# EAGLE design attinier85-power-shield-mk-2.0 (EAGLE 6.5.0)
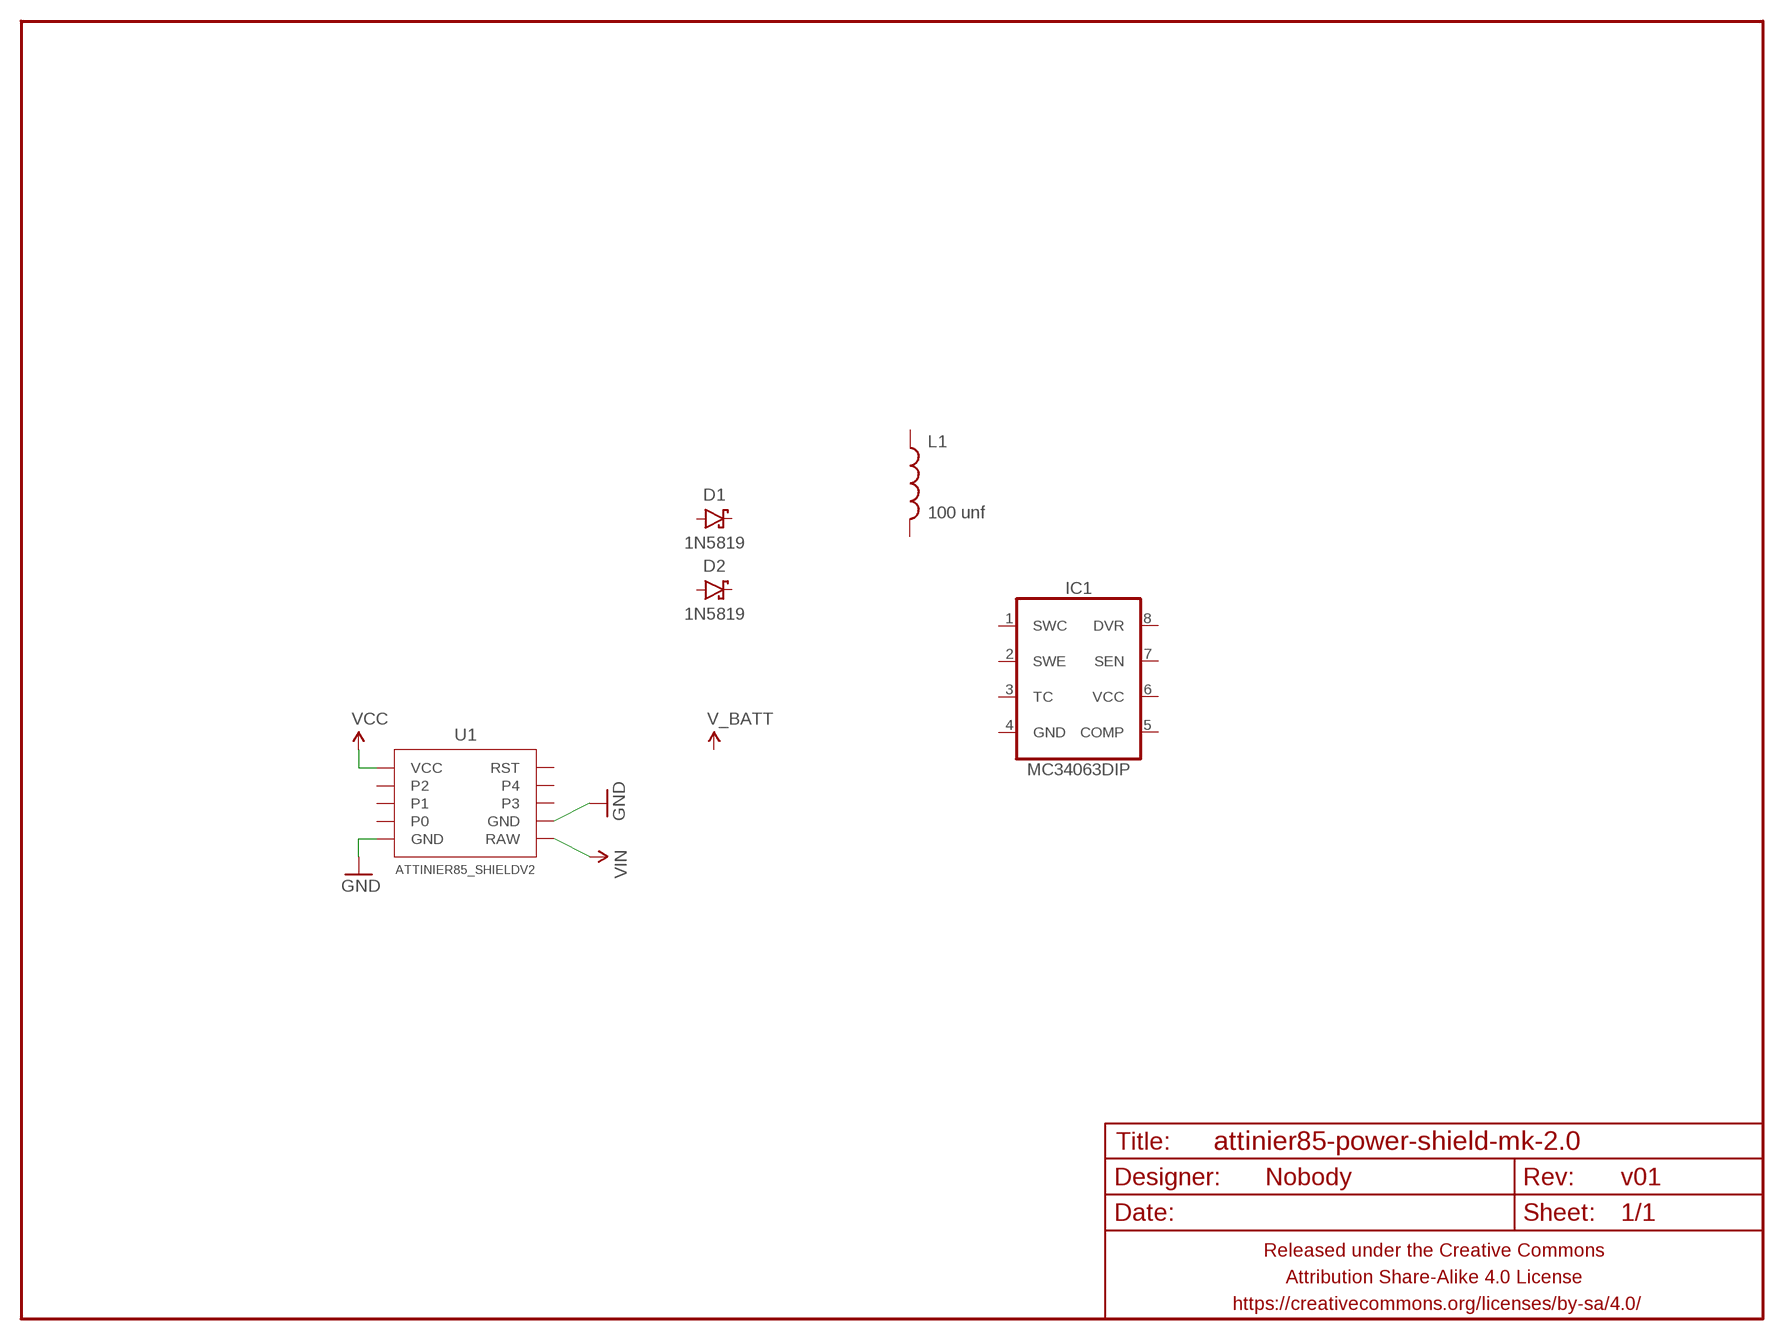
[diagram p0: schematic, sheet 1]

## Parts
D1  1N5819  DIODE-SCHOTTKYPTH-10.16MM  [DIODE-10.16MM]
D2  1N5819  DIODE-SCHOTTKYPTH-10.16MM  [DIODE-10.16MM]
FRAME1  FRAME-LETTERNO_PACKAGE  [DUMMY]
IC1  MC34063DIP  [DIP-08]
L1  100 unf  INDUCTORAXIAL-PTH-10.16MM  [INDUCTOR-AXIAL-PTH-10.16MM]
U1  ATTINIER85_SHIELDV2  [ATTINIER85_SHIELD_V2]

## Nets
GND: U1.GND@1(GND) U1.GND@2(GND)
VCC: U1.VCC
VIN: U1.RAW
Unconnected: D1.A D1.C D2.A D2.C IC1.1(SWC) IC1.2(SWE) IC1.3(TC) IC1.4(GND) IC1.5(COMP) IC1.6(VCC) IC1.7(SEN) IC1.8(DVR) L1.P$1 L1.P$2 U1.0 U1.1 U1.2 U1.3 U1.4 U1.RST

## Library data of the parts
D1 D2 = A_butts:DIODE-SCHOTTKY: Schottky diodes in SFE's production catalog BAT20J 1A 23V 0.62Vf RB751 120mA 40V 0.37Vf PMEG4005EJ 0.5A 40V 0.42Vf MBRA140 1A 40V 0.5Vf B340A 3A 40V SMA
FRAME1 = A_butts:FRAME-LETTER: Schematic Frame Standard 8.5x11 US Letter frame; DESIGNER: Nobody; VERSION: v01
IC1 = A_butts:MC34063: Jellybean switching supply controller
L1 = A_butts:INDUCTOR: Inductors Basic Inductor/Choke - 0603 and 1206. Footprints are not proven and vary greatly between part numbers. SRN6045- 33uH, 20% 1.4A SDR0403-560KL - 56uH, 10%, 500mA RMS/740mA peak
U1 = A_butts:ATTINIER85_SHIELD

## Board
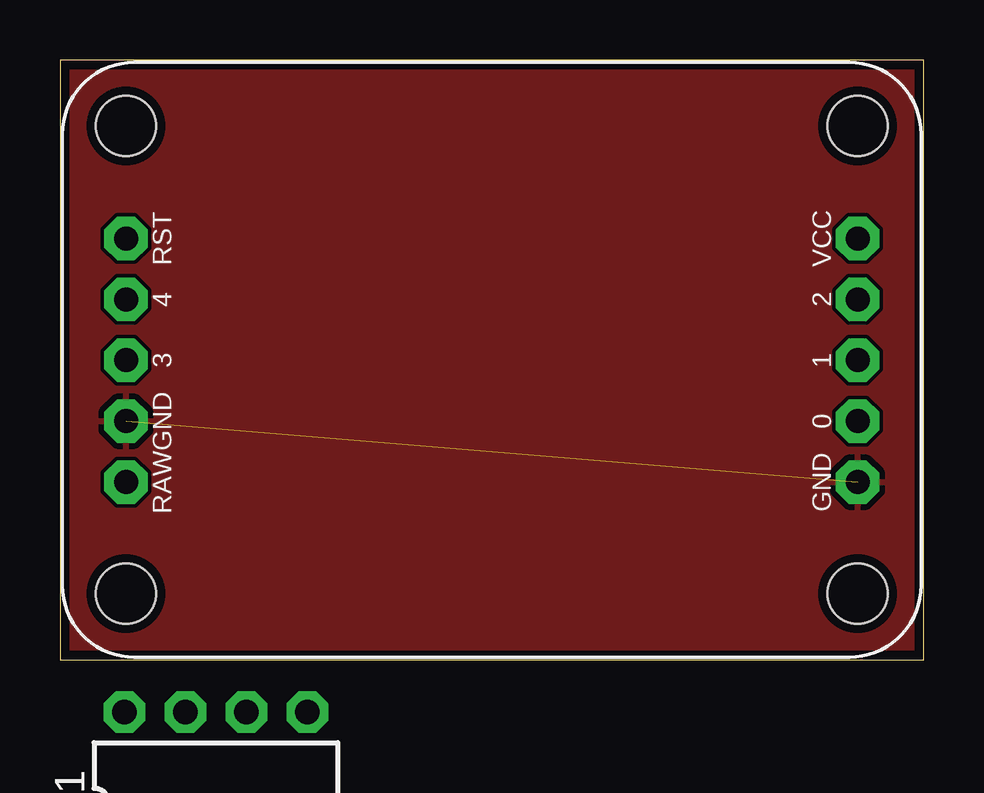
[diagram p1: board, top side]
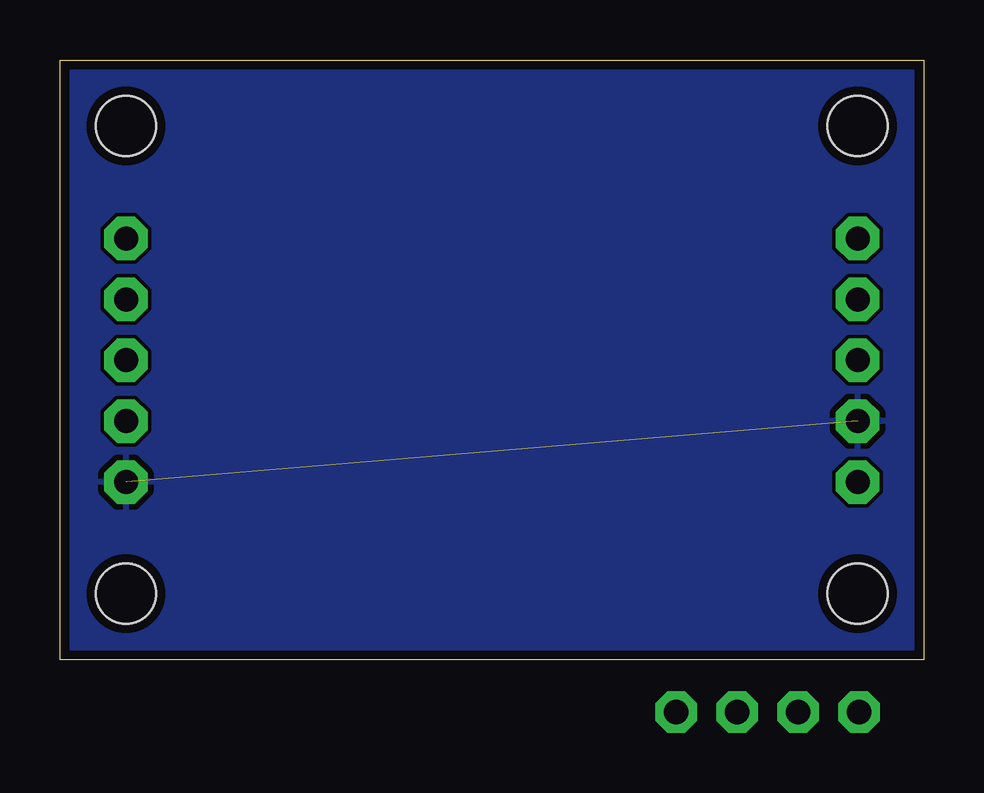
[diagram p2: board, bottom side, seen from below]

Size 36 x 25 mm. Coordinates in mm from the lower left corner, seen from the top.
Outline: 0,0 36,0 36,25 0,25 0,0
Copper layers (1*16): Top 0.0356mm / dielectric 1.5011mm / Bottom 0.0356mm
Design rules "LaenPCBOrder_2": minimum track width 6mil, minimum drill 13mil, track to track 6mil, track to pad 6mil, pad to pad 6mil, via to via 6mil, smd to smd 6mil, copper to edge 15mil, drill to drill 6mil, minimum pad ring 7mil, minimum via ring 7mil, stop-mask expansion 3mil, vias tented up to drill 20mil, thermal gap 10mil

### Footprints (pad centres in the part's own frame; a part is rotated, then mirrored left to right if it is on the bottom)
DIODE-10.16MM = drill 1.1 pad 1.778: A -5.08,0; C 5.08,0
DIP-08 = drill 1.016 pad 1.727 square: 1 -3.81,-3.81 | drill 1.016 pad 1.727 octagon: 2 -1.27,-3.81; 3 1.27,-3.81; 4 3.81,-3.81; 5 3.81,3.81; 6 1.27,3.81; 7 -1.27,3.81; 8 -3.81,3.81
INDUCTOR-AXIAL-PTH-10.16MM = drill 1.27 pad 1.93 octagon: P$1 -5.08,0; P$2 5.08,0
ATTINIEST85_SHIELD_V2 = drill 1 pad 1.8 octagon: 0 15.25,-2.56; 1 15.25,-0.02; 2 15.25,2.52; 3 -15.25,-0.02; 4 -15.25,2.52; GND@1 -15.25,-2.56; GND@2 15.25,-5.1; RAW -15.25,-5.1; RST -15.25,5.06; VCC 15.25,5.06 | hole 2.5: -15.25,-9.75; -15.25,9.75; 15.25,9.75; 15.25,-9.75

### Placement (x,y rotation side)
D1  5.5,-16.5 0 top  (outside the outline)
D2  5.5,-20 0 top  (outside the outline)
FRAME1  0,0 0 top
IC1  6.5,-6 0 top
L1  6.5,-13 0 top  (outside the outline)
U1  ATTINIEST85_SHIELDV2  [ATTINIEST85_SHIELD_V2]  18,12.5 0 top

### Tracks (layer width: path | path; a pad name or v marks a point on that pad's centre or on a via)
GND  (1 unrouted)
  pour Top: -0.1,-0.1 -0.1,25.1 36.1,25.1 36.1,-0.1
  pour Bottom: -0.1,-0.1 -0.1,25.1 36.1,25.1 36.1,-0.1